# EAGLE design RobotBooster_v2 (EAGLE 6.1)
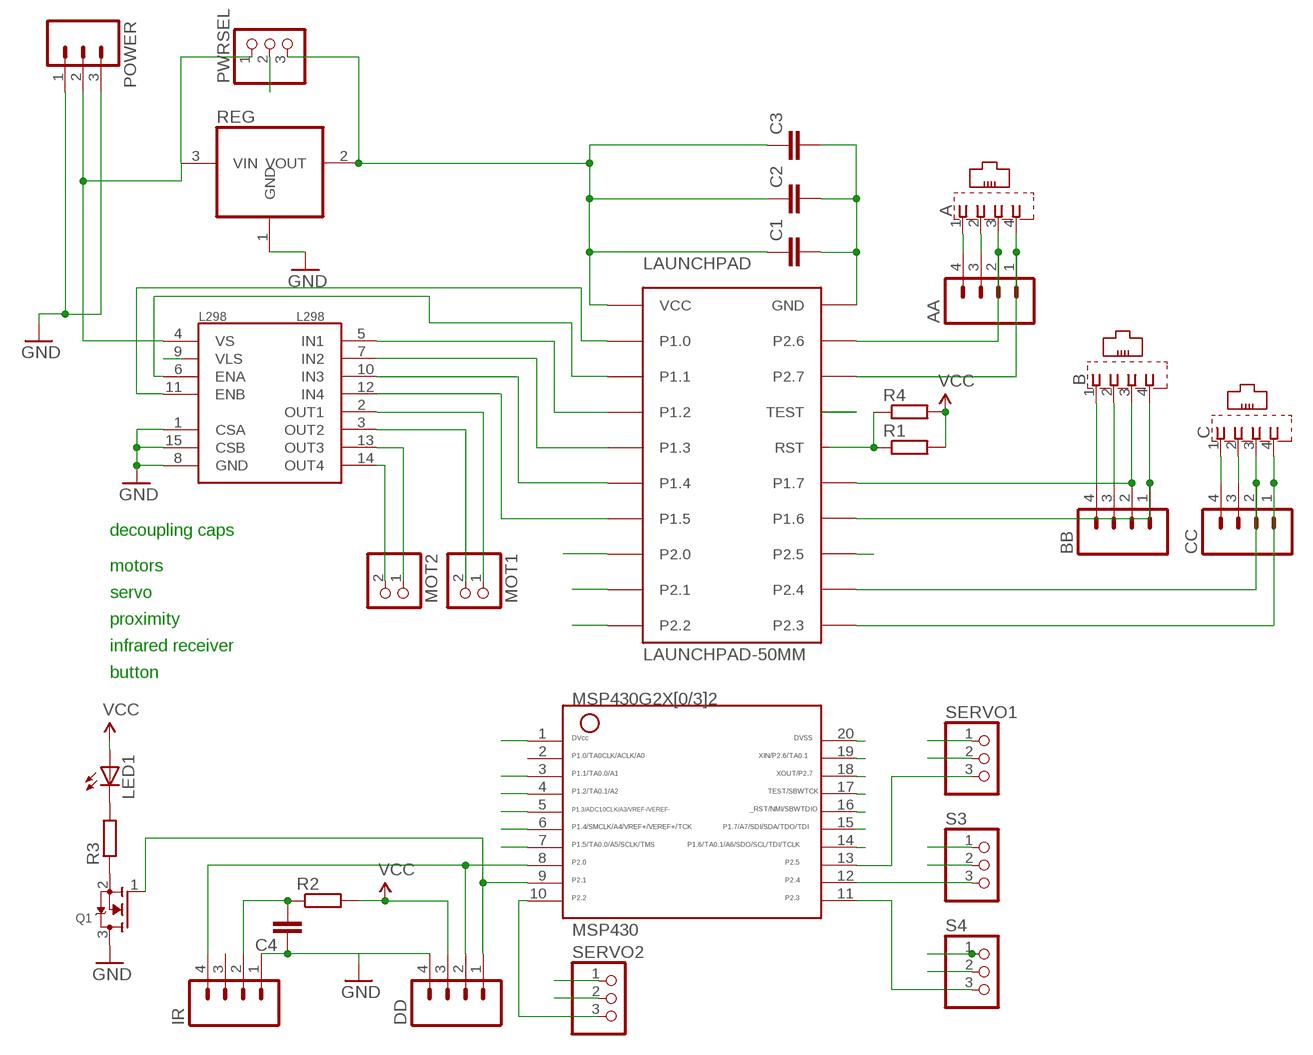
[diagram p0: schematic, sheet 1]

## Parts
A  XRJK-S-01-6-4-0-9M2  [XRJK-S-01-6-4-0-9M2]
AA  M04PTH  [1X04]
B  XRJK-S-01-6-4-0-9M2  [XRJK-S-01-6-4-0-9M2]
BB  M04PTH  [1X04]
C  XRJK-S-01-6-4-0-9M2  [XRJK-S-01-6-4-0-9M2]
C1  C-EU025-030X050  [C025-030X050]
C2  C-EU025-030X050  [C025-030X050]
C3  C-EUC1206  [C1206]
C4  C-EUC1206  [C1206]
CC  M04PTH  [1X04]
DD  M04PTH  [1X04]
IR  M04PTH  [1X04]
L298  L298  [MULTIWATT15]
LAUNCHPAD  LAUNCHPAD-50MM  [LAUNCHPAD-50MM]
LED1  LED5MM  [LED5MM]
MOT1  PINHD-1X2  [1X02]
MOT2  PINHD-1X2  [1X02]
MSP430  MSP430  G2X[0/3]2---N20  [N20]
POWER  M03LONGPADS  [1X03_LONGPADS]
PWRSEL  PINHD-1X3  [1X03]
Q1  MOSFET-NREFLOW  [SOT23]
R1  R-EU_0207/10  [0207/10]
R2  R-EU_R1206  [R1206]
R3  R-EU_R1206  [R1206]
R4  R-EU_R1206  [R1206]
REG  REG1117  [SOT223]
S3  PINHD-1X3  [1X03]
S4  PINHD-1X3  [1X03]
SERVO1  PINHD-1X3  [1X03]
SERVO2  PINHD-1X3  [1X03]

## Nets
GND: A.1 AA.4 B.1 BB.4 C1.2 C2.2 C3.2 C4.1 C.1 CC.4 DD.4 IR.1 L298.1(CSA) L298.8(GND) L298.15(CSB) LAUNCHPAD.GND MSP430.20 POWER.1 POWER.3 Q1.3(D) REG.1(GND) S3.1 S4.1 SERVO1.1 SERVO2.1
N$1: L298.14(OUT4) MOT2.2
N$2: L298.13(OUT3) MOT2.1
N$3: L298.3(OUT2) MOT1.2
N$4: L298.2(OUT1) MOT1.1
N$5: C4.2 IR.2 R2.1
N$6: Q1.2(S) R3.1
N$7: LED1.K(C) R3.2
N$10: MSP430.13 SERVO1.3
P1.0: L298.11(ENB) LAUNCHPAD.P1.0
P1.1: L298.6(ENA) LAUNCHPAD.P1.1 MSP430.3
P1.2: L298.5(IN1) LAUNCHPAD.P1.2 MSP430.4
P1.3: L298.7(IN2) LAUNCHPAD.P1.3 MSP430.5
P1.4: L298.10(IN3) LAUNCHPAD.P1.4 MSP430.6
P1.5: L298.12(IN4) LAUNCHPAD.P1.5 MSP430.7
P1.6: B.4 BB.1 LAUNCHPAD.P1.6 MSP430.14
P1.7: B.3 BB.2 LAUNCHPAD.P1.7 MSP430.15
P2.0: DD.2 IR.4 LAUNCHPAD.P2.0 MSP430.8
P2.1: DD.1 LAUNCHPAD.P2.1 MSP430.9 Q1.1(G)
P2.2: LAUNCHPAD.P2.2 MSP430.10 SERVO2.3
P2.3: C.4 CC.1 LAUNCHPAD.P2.3 MSP430.11 S4.3
P2.4: C.3 CC.2 LAUNCHPAD.P2.4 MSP430.12 S3.3
P2.5: LAUNCHPAD.P2.5
P2.6: A.3 AA.2 LAUNCHPAD.P2.6 MSP430.19
P2.7: A.4 AA.1 LAUNCHPAD.P2.7 MSP430.18
RST: LAUNCHPAD.RST MSP430.16 R1.1 R4.1
TEST: LAUNCHPAD.TEST MSP430.17
VBAT: L298.4(VS) POWER.2 PWRSEL.1 REG.3(VIN)
VCC: A.2 AA.3 B.2 BB.3 C1.1 C2.1 C3.1 C.2 CC.3 DD.3 L298.9(VLS) LAUNCHPAD.VCC LED1.A MSP430.1 PWRSEL.3 R1.2 R2.2 R4.2 REG.2(VOUT)
VSERV: PWRSEL.2 S3.2 S4.2 SERVO1.2 SERVO2.2
Unconnected: IR.3 MSP430.2

## Notes on the sheet
- decoupling caps
- motors
- servo
- proximity
- infrared receiver
- button

## Library data of the parts
A B C = apus-spidisplay:XRJK*4: RJ11 Connector without LED, 6 position, 4 contacts, thrue hole Source: XRJK-S-01-6-4-0-9M2(01).pdf
AA BB CC DD IR = SparkFun-Connectors:M04: Header 4 Standard 4-pin 0.1" header. Use with straight break away headers (SKU : PRT-00116), right angle break away headers (PRT-00553), swiss pins (PRT-00743), machine pins (PRT-00117), and female headers (PRT-00115). Molex polarized connector foot print use with SKU : PRT-08231 with associated crimp pins and housings. 1MM SMD Version SKU: PRT-10208
C1-C4 = resistor:C-EU: CAPACITOR, European symbol
L298 = SparkFun-PowerIC:L298: L298 Dual Full Bridge Driver
LAUNCHPAD = TI_launchpad:LAUNCHPAD: MSP-EXP430G2 LaunchPad Booster Pack layouts. LAUNCHPAD: Full-size board LAUNCHPAD-50MM: 50x50mm board covering the button area LAUNCHPAD-50MM-LEFT: 50x50mm board leaving the button area open. Tall LaunchPad components marked on Reference for reference.
LED1 = adafruit:LED: LED OSRAM: - CHIPLED LG R971, LG N971, LY N971, LG Q971, LY Q971, LO R971, LY R971 LH N974, LH R974 LS Q976, LO Q976, LY Q976 LO Q996 - Hyper CHIPLED LW Q18S LB Q993, LB Q99A, LB R99A - SideLED LS A670, LO A670, LY A670, LG A670, LP A670 LB A673, LV A673, LT A673, LW A673 LH A674 LY A675 LS A676, LA A676, LO A676, LY A676, LW A676 LS A679, LY A679, LG A679 - Hyper Micro SIDELED® LS Y876, LA Y876, LO Y876, LY Y876 LT Y87S - SmartLED LW L88C, LW L88S LB L89C, LB L89S, LG L890 LS L89K, LO L89K, LY L89K LS L896, LA L896, LO L896, LY L896 - TOPLED LS T670, LO T670, LY T670, LG T670, LP T670 LSG T670, LSP T670, LSY T670, LOP T670, LYG T670 LG T671, LOG T671, LSG T671 LB T673, LV T673, LT T673, LW T673 LH T674 LS T676, LA T676, LO T676, LY T676, LB T676, LH T676, LSB T676, LW T676 LB T67C, LV T67C, LT T67C, LS T67K, LO T67K, LY T67K, LW E67C LS E67B, LA E67B, LO E67B, LY E67B, LB E67C, LV E67C, LT E67C LW T67C LS T679, LY T679, LG T679 LS T770, LO T770, LY T770, LG T770, LP T770 LB T773, LV T773, LT T773, LW T773 LH T774 LS E675, LA E675, LY E675, LS T675 LS T776, LA T776, LO T776, LY T776, LB T776 LHGB T686 LT T68C, LB T68C - Hyper Mini TOPLED® LB M676 - Mini TOPLED Santana® LG M470 LS M47K, LO M47K, LY M47K Source: http://www.osram.convergy.de/
MOT1 MOT2 = pinhead:PINHD-1X2: PIN HEADER
MSP430 = TI_MSP430_v16:G2X[0/3]2---N20: MSP430G2X[0/3]2 MSP430G2x32, MSP430G2x02 PDIP (N) 20 Pin Package http://focus.ti.com/docs/prod/folders/print/msp430g2432.html
POWER = SparkFun-Connectors:M03: Header 3 Standard 3-pin 0.1" header. Use with straight break away headers (SKU : PRT-00116), right angle break away headers (PRT-00553), swiss pins (PRT-00743), machine pins (PRT-00117), and female headers (PRT-00115). Molex polarized connector foot print use with SKU : PRT-08232 with associated crimp pins and housings.
PWRSEL S3 S4 SERVO1 SERVO2 = adafruit:PINHD-1X3: PIN HEADER
Q1 = adafruit:MOSFET-N: N-Channel Mosfet 2N7002E - 60V 260mA SOT23 [Digikey: 2N7002ET1GOSTR-ND] - REEL BSH103 - 30V 850mA SOT23 [Digikey: 568-5013-1-ND]
R1-R4 = resistor:R-EU_: RESISTOR, European symbol
REG = burr-brown:REG1117: 800mA and 1A Low Dropout (LDO) Positive Regulator 1.8V, 2.5V, 2.85V, 3.3V, 5V, and Adj; MPN: REG1117; OC_FARNELL: 1097566; OC_NEWARK: 14P6981

## Board
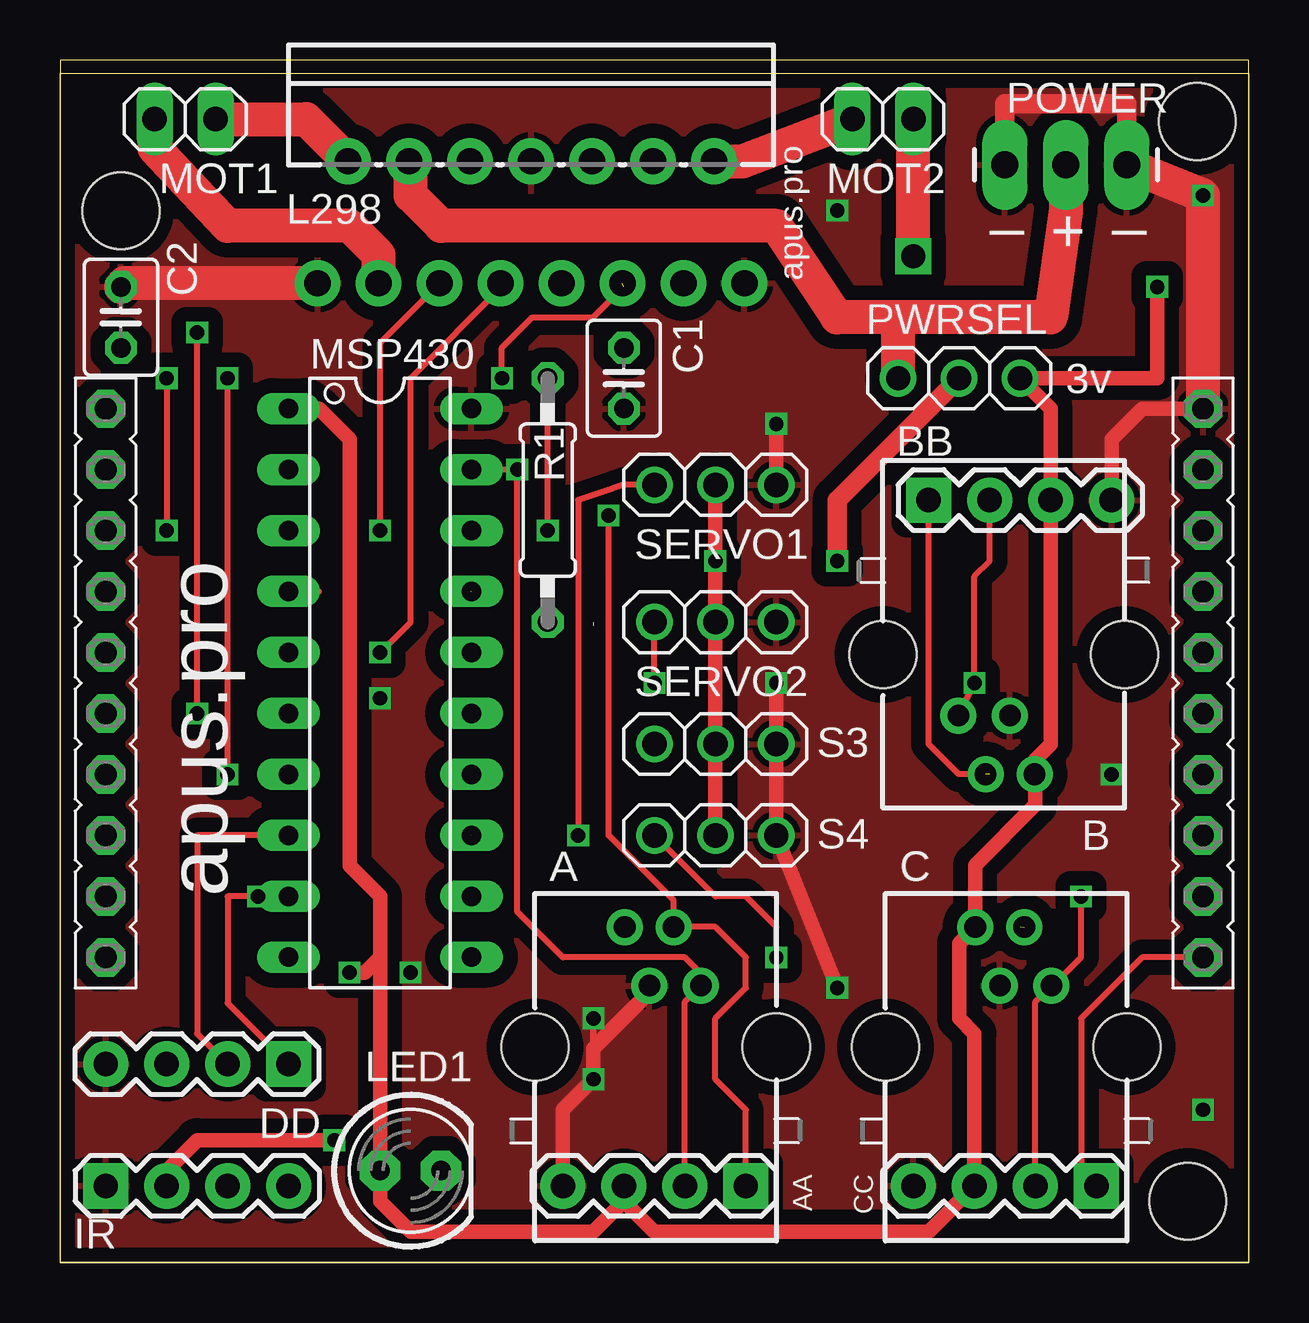
[diagram p1: board, top side]
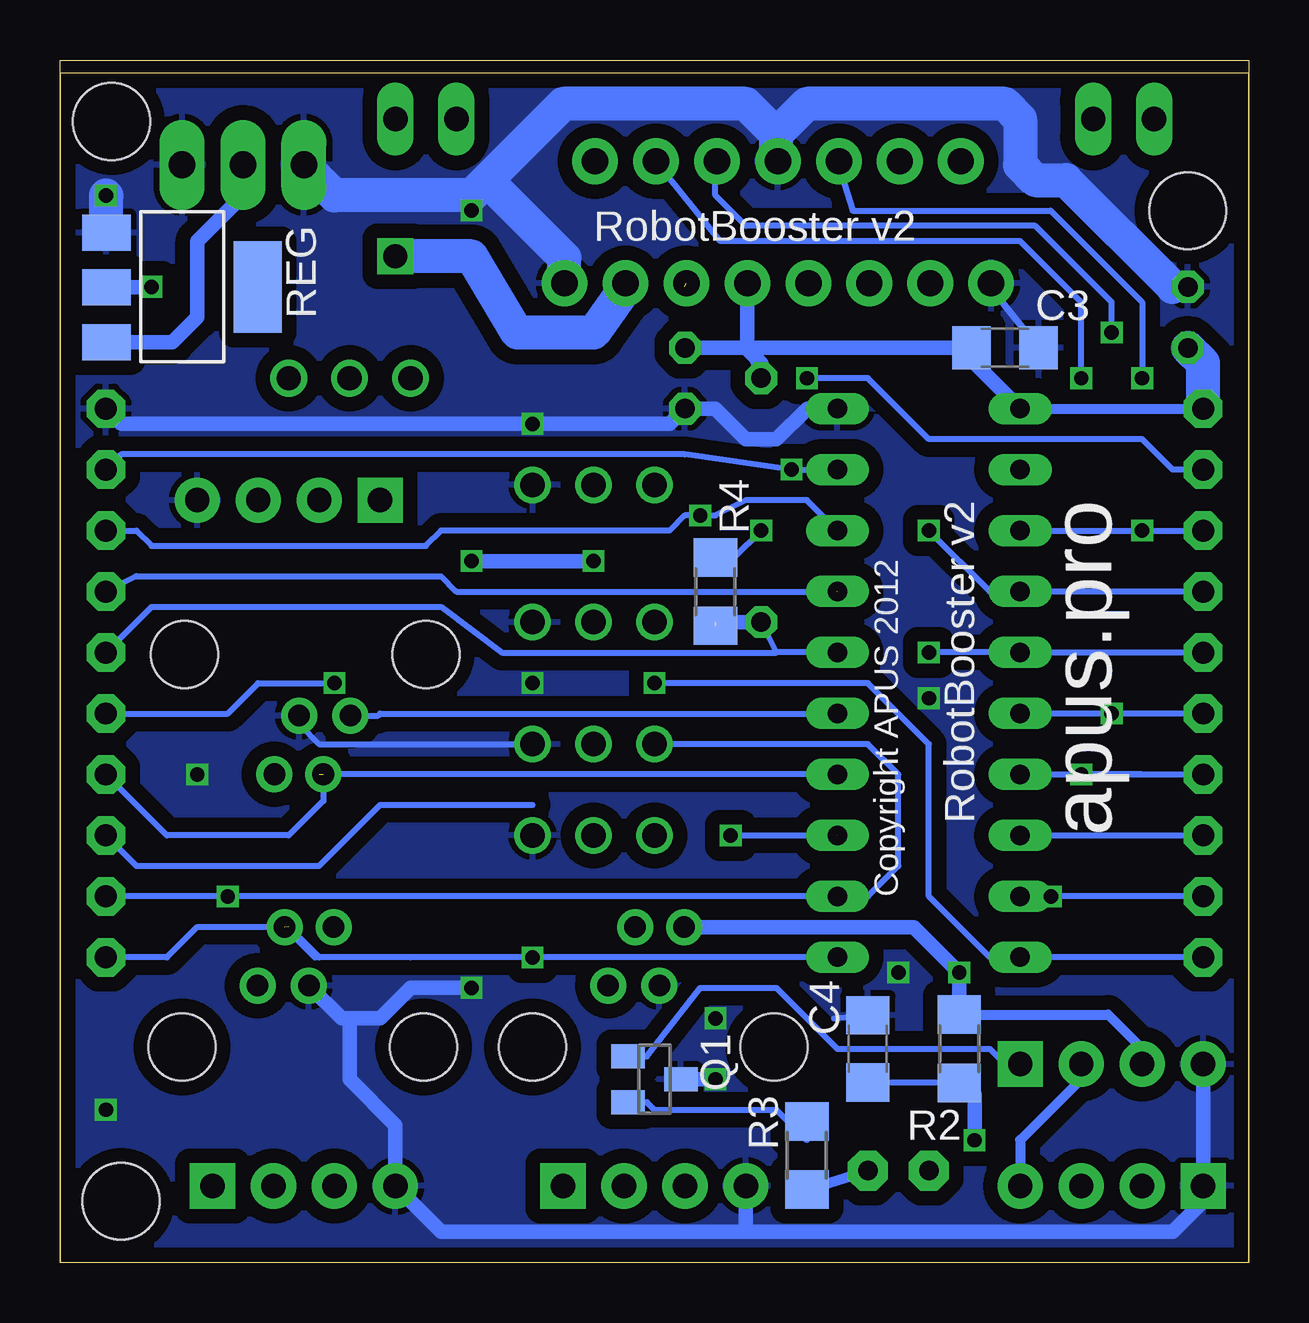
[diagram p2: board, bottom side, seen from below]

Size 49.54 x 50.12 mm. Coordinates in mm from the lower left corner, seen from the top.
Outline: 0,0 49.54,0 49.54,50.12 0,50.12 0,0
Copper layers (1*16): Top 0.035mm / dielectric 1.5mm / Bottom 0.035mm
Design rules: minimum track width 6mil, minimum drill 12mil, track to track 6mil, track to pad 6mil, pad to pad 6mil, via to via 6mil, smd to smd 0mil, copper to edge 10mil, drill to drill 10mil, minimum pad ring 10mil, minimum via ring 6mil, stop-mask expansion 2mil, vias tented up to drill 100mil, thermal gap 10mil
Holes 3.2 mm at 46.99,2.57 47.39,47.55 2.54,43.84

### Footprints (pad centres in the part's own frame; a part is rotated, then mirrored left to right if it is on the bottom)
XRJK-S-01-6-4-0-9M2 = drill 0.9 pad 1.5: 1 -0.205,-2.45; 2 -1.235,-0.01; 3 1.935,-2.45; 4 0.805,-0.01 | hole 2.8: -4.98,-5; 5.08,-5
1X04 = drill 1.016 pad 1.88 square: 1 0,0 | drill 1.016 pad 1.88: 2 2.54,0; 3 5.08,0; 4 7.62,0
C025-030X050 = drill 0.813 octagon: 1 -1.27,0; 2 1.27,0
C1206 = smd 1.6 x 1.8: 1 -1.4,0; 2 1.4,0
MULTIWATT15 = drill 1.1 pad 1.9: 1 -8.95,-2.39; 2 -7.68,2.69; 3 -6.41,-2.39; 4 -5.14,2.69; 5 -3.87,-2.39; 6 -2.6,2.69; 7 -1.33,-2.39; 8 -0.06,2.69; 9 1.21,-2.39; 10 2.48,2.69; 11 3.75,-2.39; 12 5.02,2.69; 13 6.29,-2.39; 14 7.56,2.69; 15 8.83,-2.39
LAUNCHPAD-50MM = drill 0.914 pad 1.6 octagon: GND 13.97,48.26; P1.0 16.51,2.54; P1.1 19.05,2.54; P1.2 21.59,2.54; P1.3 24.13,2.54; P1.4 26.67,2.54; P1.5 29.21,2.54; P1.6 29.21,48.26; P1.7 26.67,48.26; P2.0 31.75,2.54; P2.1 34.29,2.54; P2.2 36.83,2.54; P2.3 36.83,48.26; P2.4 34.29,48.26; P2.5 31.75,48.26; P2.6 16.51,48.26; P2.7 19.05,48.26; RST 24.13,48.26; TEST 21.59,48.26; VCC 13.97,2.54
LED5MM = drill 0.813 pad 1.676 octagon: A -1.27,0; K 1.27,0
1X02 = drill 1.016 long: 1 -1.27,0; 2 1.27,0
N20 = drill 0.813 long: 1 -11.435,-3.81; 2 -8.895,-3.81; 3 -6.355,-3.81; 4 -3.815,-3.81; 5 -1.275,-3.81; 6 1.265,-3.81; 7 3.805,-3.81; 8 6.345,-3.81; 9 8.885,-3.81; 10 11.425,-3.81; 11 11.425,3.81; 12 8.885,3.81; 13 6.345,3.81; 14 3.805,3.81; 15 1.265,3.81; 16 -1.275,3.81; 17 -3.815,3.81; 18 -6.355,3.81; 19 -8.895,3.81; 20 -11.435,3.81
1X03_LONGPADS = drill 1.118 pad 1.88 long: 1 0,0; 2 2.54,0; 3 5.08,0
1X03 = drill 1.016: 1 -2.54,0; 2 0,0; 3 2.54,0
SOT23 = smd 1 x 1.4: 1 -0.95,-1.1; 2 0.95,-1.1; 3 0,1.1
0207/10 = drill 0.813 octagon: 1 -5.08,0; 2 5.08,0
R1206 = smd 1.6 x 1.803: 1 -1.422,0; 2 1.422,0
SOT223 = smd 1.499 x 2.007: 1 -2.261,-3.15; 2 0.025,-3.15; 3 2.311,-3.15 | smd 3.81 x 2.007: 4 0,3.15

### Placement (x,y rotation side)
A  24.76,14 0 top
AA  28.57,3.2 180 top
B  39.37,20.35 180 top
BB  36.2,31.78 0 top
C  39.37,14 0 top
C1  23.49,36.86 270 top
C2  2.54,39.4 90 top
C3  10.16,38.13 0 bottom
C4  15.88,8.92 270 bottom
CC  43.18,3.2 180 top
DD  9.53,8.29 180 top
IR  1.91,3.2 0 top
L298  19.68,43.21 0 top
LAUNCHPAD  -0.64,49.56 270 top
LED1  14.61,3.84 0 top
MOT1  5.21,47.66 180 top
MOT2  34.29,47.66 180 top
MSP430  13.34,24.16 270 top
POWER  39.37,45.75 0 top
PWRSEL  37.47,36.86 0 top
Q1  24.76,7.65 270 bottom
R1  20.32,31.78 90 top
R2  12.06,8.92 90 bottom
R3  18.41,4.48 270 bottom
R4  22.22,27.97 90 bottom
REG  44.45,40.67 270 bottom
S3  27.3,21.62 180 top
S4  27.3,17.81 180 top
SERVO1  27.3,32.41 180 top
SERVO2  27.3,26.7 180 top

### Tracks (layer width: path | path; a pad name or v marks a point on that pad's centre or on a via)
GND  (via drill 0.6)
  Top 0.254: LAUNCHPAD.GND | 22.22,8.92 v22.22,10.19 v22.22,7.65 22.22,9.21 A.1
  Top 0.61: v29.84,24.16 S3.1 S4.1 v32.39,11.46 | 24.76,11.46 22.22,8.92 v22.22,7.65 20.95,6.38 AA.4 | BB.4 43.82,34.32 45.09,35.59 LAUNCHPAD.GND | SERVO1.1 v29.84,34.96
  Top 0.813: POWER.3 44.45,48.29 39.37,48.29 POWER.1
  Top 1.422: LAUNCHPAD.GND v47.62,44.48 POWER.3 | L298.1 2.69,40.82 C2.2
  Bottom 0.254: B.1 39.58,22.46 38.73,21.62 S3.1 | A.1 24.67,11.55 | 17.27,10.19 C4.1 | 22.09,10.32 v22.22,10.19
  Bottom 0.305: C3.2 10.79,40.67
  Bottom 0.406: IR.1 DD.4
  Bottom 0.61: MSP430.20 18.41,35.59 19.68,34.32 20.95,34.32 22.22,35.59 C1.2 24.12,34.96 v29.84,34.96 46.98,34.96 LAUNCHPAD.GND | v22.22,7.65 Q1.3 | 37.47,10.19 37.47,7.65 35.56,5.75 CC.4 33.66,1.3 20.95,1.3 | 37.47,10.19 37.8,10.19 C.1 | 37.47,10.19 36.2,10.19 34.93,11.46 v32.39,11.46 | DD.4 1.91,2.57 3.17,1.3 20.95,1.3 | AA.4 20.95,1.3
  Bottom 0.813: C2.2 3.17,40.67 | L298.8 19.62,46.96
  Bottom 1.422: REG.1 47.6,44.45 v47.62,44.48 | 19.68,47.02 18.41,48.29 10.16,48.29 9.53,47.66 9.53,45.75 8.89,45.12 7.62,45.12 3.17,40.67 | 19.68,45.75 19.68,47.02 | 19.68,47.02 20.95,48.29 28.57,48.29 31.75,45.12 | POWER.1 38.1,44.48 32.39,44.48 31.75,45.12 | L298.15 28.51,41.88 31.75,45.12 | 10.79,40.67 10.79,40.76 L298.1
  other vias: 43.82,20.35 47.62,6.38 13.34,23.53 14.61,12.09 32.39,43.84
  pour Bottom (isolate 0.61): -0.64,49.56 48.9,49.56 48.9,0.03 -0.64,0.03
  pour Top (isolate 0.61): -0.64,49.56 48.9,49.56 48.9,0.03 -0.64,0.03
N$1
  Top 1.422: L298.14 28.42,45.9 MOT2.2
N$2  (via drill 1)
  Top 1.422: v35.56,41.94 MOT2.1
  Bottom 1.422: L298.13 25.97,40.61 27.3,38.77 30.48,38.77 32.39,41.94 v35.56,41.94
N$3
  Top 1.422: L298.3 13.28,42 12.06,43.21 6.99,43.21 3.95,46.45 MOT1.2
N$4
  Top 1.422: MOT1.1 10.25,47.66 L298.2
N$5  (via drill 0.6)
  Top 0.61: IR.2 4.45,3.84 5.71,5.11 v11.43,5.11
  Bottom 0.254: R2.1 15.85,7.5 C4.2
  Bottom 0.61: v11.43,5.11 11.43,7.02 12.06,7.65 R2.1
N$6
  Bottom 0.254: R3.1 18.41,5.11 19.68,6.38 24.76,6.38 25.08,6.7 Q1.2
N$7
  Bottom 0.406: R3.2 LED1.K
N$10  (via drill 0.6)  (1 unrouted)
  Top 0.254: SERVO1.3 23.49,32.41 21.59,31.78 v21.59,17.81
  Bottom 0.254: v21.59,17.81 MSP430.13
P1.0  (via drill 0.6)  (1 unrouted)
  Top 0.254: v18.41,36.86 18.41,38.13 19.68,39.4 22.22,39.4 23.49,40.67
  Bottom 0.254: LAUNCHPAD.P1.0 3.18,33.05 4.45,34.32 13.34,34.32 15.88,36.86 v18.41,36.86
P1.1  (via drill 0.6)
  Top 0.254: v4.45,36.86 v4.45,30.52
  Bottom 0.254: MSP430.3 v4.45,30.52 LAUNCHPAD.P1.1 | L298.6 17.08,45.69 16.51,43.84 8.26,43.84 4.45,40.04 v4.45,36.86
P1.2  (via drill 0.6)
  Top 0.254: MSP430.4 10.8,27.98 | v13.34,30.51 13.34,38.34 L298.5
  Bottom 0.254: v13.34,30.51 10.8,27.98 MSP430.4 LAUNCHPAD.P1.2
P1.3  (via drill 0.6)
  Top 0.254: L298.7 18.35,40.73 18.41,40.67 14.61,36.86 14.61,26.7 v13.34,25.43
  Bottom 0.254: LAUNCHPAD.P1.3 MSP430.5 v13.33,25.44 v13.34,25.43
P1.4  (via drill 0.6)
  Top 0.254: v5.71,22.89 v5.71,38.77
  Bottom 0.254: 8.25,22.89 MSP430.6 | MSP430.6 LAUNCHPAD.P1.4 | MSP430.6 v5.72,22.89 v5.71,22.89 | L298.10 22.22,45.84 22.22,44.48 20.95,43.21 8.89,43.21 5.71,40.04 v5.71,38.77
P1.5  (via drill 0.6)
  Top 0.254: v6.99,20.35 v6.99,36.86
  Bottom 0.254: 8.25,20.35 MSP430.7 | MSP430.7 | MSP430.7 LAUNCHPAD.P1.5 | MSP430.7 4.45,20.36 v6.99,20.35 | L298.12 22.01,42.58 9.53,42.58 6.99,40.04 v6.99,36.86
P1.6  (1 unrouted)
  Top 0.254: B.4 37.46,20.36 36.2,21.62 BB.1
  Bottom 0.254: B.4 38.57,19.25 40.01,17.81 45.09,17.81 LAUNCHPAD.P1.6 | MSP430.14 38.73,20.36 38.73,20.35
P1.7  (via drill 0.6)
  Top 0.254: v38.1,24.16 37.44,22.86 B.3 38.1,24.1 v38.1,24.16 | v38.1,24.16 38.1,28.61 38.73,29.24 BB.2
  Bottom 0.254: LAUNCHPAD.P1.7 42.55,22.89 41.27,24.16 v38.1,24.16 | B.3 36.29,22.8 36.2,22.89 MSP430.15
P2.0
  Top 0.254: MSP430.8 5.72,17.82 5.71,17.81 5.71,9.55 DD.2
  Bottom 0.254: MSP430.8 LAUNCHPAD.P2.0
  Bottom 0.406: DD.2 6.99,7.65 9.53,5.11 IR.4
P2.1  (via drill 0.6)
  Top 0.254: v8.25,15.27 6.99,15.27 6.99,10.82 DD.1
  Bottom 0.254: LAUNCHPAD.P2.1 v8.25,15.27 MSP430.9 | DD.1 10.16,8.29 10.79,8.92 17.14,8.92 19.68,11.46 22.86,11.46 25.08,8.6 Q1.1 25.86,8.75 26.04,8.92
P2.2  (via drill 0.6)
  Top 0.254: v24.76,24.16 SERVO2.3
  Bottom 0.254: LAUNCHPAD.P2.2 MSP430.10 10.8,12.73 13.34,15.27 13.34,21.62 15.88,24.16 v24.76,24.16
P2.3  (via drill 0.6)  (1 unrouted)
  Top 0.254: LAUNCHPAD.P2.3 45.09,12.73 42.55,10.19 42.55,3.84 CC.1 | v29.84,12.73 29.84,14 28.57,15.27 27.3,15.27 S4.3
  Bottom 0.254: 38.91,12.73 C.4 43.82,14 45.09,12.73 LAUNCHPAD.P2.3 | 40.01,14 38.73,12.73 34.93,12.73 33.65,12.73 MSP430.11 v29.84,12.73
P2.4  (via drill 0.6)
  Top 0.254: CC.2 40.64,10.88 C.3 41.37,11.55 42.55,12.73 v42.55,15.27
  Bottom 0.254: LAUNCHPAD.P2.4 v42.55,15.27 18.41,15.27 MSP430.12 15.87,15.27 14.61,16.54 14.61,20.35 15.88,21.62 S3.3
P2.5
  Bottom 0.254: LAUNCHPAD.P2.5 46.36,16.54 38.73,16.54 36.2,19.08 29.84,19.08
P2.6  (via drill 0.6)
  Top 0.254: AA.2 26.04,10.88 A.3 26.7,12.06 26.04,12.73 20.95,12.73 19.05,14.63 v19.05,33.05 | v19.05,33.05 18.41,33.05 | v19.05,33.05
  Bottom 0.254: MSP430.19 v19.05,33.05 23.49,33.69 46.99,33.69 LAUNCHPAD.P2.6
P2.7  (via drill 0.6)
  Top 0.254: v22.86,31.14 22.86,17.81 25.57,15.1 A.4 25.58,14 27.3,14 28.57,12.73 28.57,11.46 27.3,10.19 27.3,7.65 28.57,6.38 AA.1
  Bottom 0.254: MSP430.18 18.41,31.78 20.95,31.78 22.22,31.14 v22.86,31.14 23.49,31.14 24.13,30.51 33.66,30.51 34.29,29.88 45.72,29.88 46.36,30.51 LAUNCHPAD.P2.7
RST  (1 unrouted)
  Bottom 0.254: MSP430.16 19.68,25.44 | R1.1 19.68,25.44 | LAUNCHPAD.RST 45.72,27.34 33.66,27.34 31.11,25.43 19.68,25.43 19.68,25.44
  Bottom 0.61: R1.1 22.22,26.7
TEST  (1 unrouted)
  Bottom 0.254: LAUNCHPAD.TEST 46.35,28.61 45.09,28.61 33.66,28.61 33.02,27.97 MSP430.17
VBAT
  Top 1.422: L298.4 14.61,45.84 14.61,44.48 15.88,43.21 29.84,43.21 32.39,39.4 34.93,39.4 | POWER.2 41.91,43.84 41.27,39.4 34.93,39.4 | PWRSEL.1 34.93,39.4
  Bottom 0.61: 47.62,38.13 47.37,38.13 REG.3 44.86,38.36 43.82,39.4 43.82,42.58 41.91,44.48 POWER.2
  Bottom 1.422: 14.61,45.96 L298.4
VCC  (via drill 0.6)
  Top 0.254: v20.32,30.51 R1.2
  Top 0.61: 13.34,12.73 LED1.A 13.34,2.57 14.61,1.3 22.22,1.3 23.49,2.57 | 13.34,12.73 13.34,15.27 12.06,16.54 12.06,34.32 10.79,35.59 MSP430.1 | v12.06,12.09 12.7,12.09 13.34,12.73 | AA.3 23.49,2.57 | 23.49,2.57 24.76,1.3 36.2,1.3 CC.3 38.1,9.55 37.47,10.19 37.47,13.32 C.2 38.14,16.58 40.64,19.08 40.64,20.33 B.2 40.61,20.95 41.27,21.62 BB.3 41.27,35.59 PWRSEL.3 45.72,36.86 v45.72,40.67
  Bottom 0.254: R1.2 20.95,38.13 | 12.06,38.13 C3.1 | LAUNCHPAD.VCC | R4.2 21.44,29.39 v20.32,30.51
  Bottom 0.406: LAUNCHPAD.VCC MSP430.1 12.06,38.13 | R2.2 5.87,10.34 4.45,8.92 DD.3
  Bottom 0.61: 20.95,40.76 L298.9 20.89,38.19 20.95,38.13 | REG.2 45.75,40.65 v45.72,40.67 | R2.2 v12.06,12.09 13.96,13.99 A.2 | C1.1 20.95,38.13 | 20.95,38.13 12.06,38.13 MSP430.1 | R1.2 20.32,37.5 20.95,38.13
  Bottom 1.422: LAUNCHPAD.VCC 1.91,37.5 C2.1
VSERV  (via drill 0.6)
  Top 0.61: S4.2 S3.2 SERVO2.2 v27.3,29.24 SERVO1.2
  Top 0.813: v32.39,29.24 32.39,31.78 PWRSEL.2
  Bottom 0.61: v32.39,29.24 v27.3,29.24

### Text on the board
tPlace: _ | _ | + | apus.pro | 3v | apus.pro
bPlace: RobotBooster v2 | apus.pro | RobotBooster v2 | Copyright APUS 2012